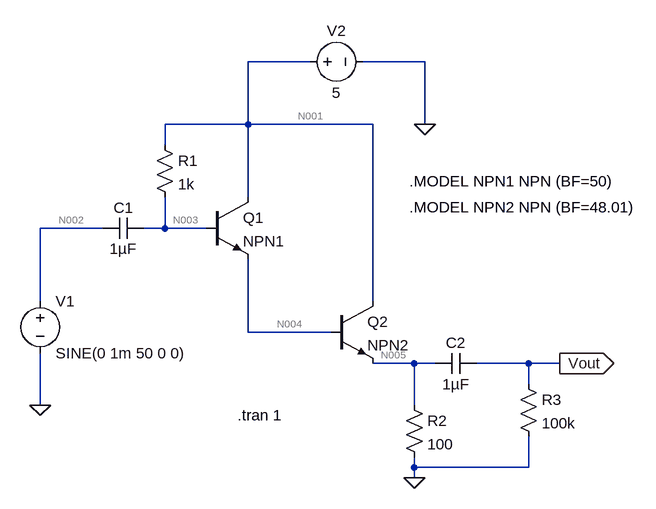
[diagram p0: schematic Q3.asc]
Q3.asc, the LTspice schematic file:
Version 4
SHEET 1 880 680
WIRE 352 -128 256 -128
WIRE 528 -128 432 -128
WIRE 256 -32 256 -128
WIRE 256 -32 128 -32
WIRE 448 -32 256 -32
WIRE 528 -32 528 -128
WIRE 128 0 128 -32
WIRE 256 80 256 -32
WIRE 32 128 -64 128
WIRE 128 128 128 80
WIRE 128 128 96 128
WIRE 192 128 128 128
WIRE -64 240 -64 128
WIRE 448 240 448 -32
WIRE 256 288 256 176
WIRE 384 288 256 288
WIRE 512 336 448 336
WIRE 544 336 512 336
WIRE 688 336 608 336
WIRE 736 336 688 336
WIRE 688 368 688 336
WIRE -64 400 -64 320
WIRE 512 400 512 336
WIRE 512 496 512 480
WIRE 688 496 688 448
WIRE 688 496 512 496
WIRE 512 512 512 496
FLAG 528 -32 0
FLAG 512 512 0
FLAG -64 400 0
FLAG 736 336 Vout
IOPIN 736 336 Out
SYMBOL res 496 384 R0
SYMATTR InstName R2
SYMATTR Value 100
SYMBOL res 112 -16 R0
SYMATTR InstName R1
SYMATTR Value 1k
SYMBOL cap 96 112 R90
WINDOW 0 0 32 VBottom 2
WINDOW 3 32 32 VTop 2
SYMATTR InstName C1
SYMATTR Value 1µF
SYMBOL voltage -64 224 R0
WINDOW 123 0 0 Left 0
WINDOW 39 0 0 Left 0
SYMATTR InstName V1
SYMATTR Value SINE(0 1m 50 0 0)
SYMBOL voltage 336 -128 R270
WINDOW 0 32 56 VTop 2
WINDOW 3 -32 56 VBottom 2
WINDOW 123 0 0 Left 0
WINDOW 39 0 0 Left 0
SYMATTR InstName V2
SYMATTR Value 5
SYMBOL npn 192 80 R0
SYMATTR InstName Q1
SYMATTR Value NPN1
SYMBOL npn 384 240 R0
SYMATTR InstName Q2
SYMATTR Value NPN2
SYMBOL cap 608 320 R90
WINDOW 0 0 32 VBottom 2
WINDOW 3 32 32 VTop 2
SYMATTR InstName C2
SYMATTR Value 1µF
SYMBOL res 672 352 R0
SYMATTR InstName R3
SYMATTR Value 100k
TEXT 504 56 Left 2 !.MODEL NPN1 NPN (BF=50)
TEXT 504 96 Left 2 !.MODEL NPN2 NPN (BF=48.01)
TEXT 240 416 Left 2 !.tran 1

The netlist it stands for:
* Q3.asc
R2 N005 0 100
R1 N001 N003 1k
C1 N003 N002 1µF
V1 N002 0 SINE(0 1m 50 0 0)
V2 N001 0 5
Q1 N001 N003 N004 0 NPN1
Q2 N001 N004 N005 0 NPN2
C2 Vout N005 1µF
R3 Vout 0 100k
.model NPN NPN
.model PNP PNP
.lib standard.bjt
.MODEL NPN1 NPN (BF=50)
.MODEL NPN2 NPN (BF=48.01)
.tran 1
.backanno
.end

* Results of the author's LTspice run, read from the files saved beside the schematic
* Operating Point, zero values left out:
*   V(n005) = 3.358 V
*   V(n001) = 5 V
*   V(n003) = 4.987 V
*   V(n004) = 4.223 V
*   Ic(Q2) = 32.9 mA
*   Ib(Q2) = 685.2 µA
*   Ie(Q2) = -33.58 mA
*   Ic(Q1) = 671.7 µA
*   Ib(Q1) = 13.43 µA
*   Ie(Q1) = -685.2 µA
*   I(R1) = 13.43 µA
*   I(R2) = 33.58 mA
*   I(V2) = -33.58 mA
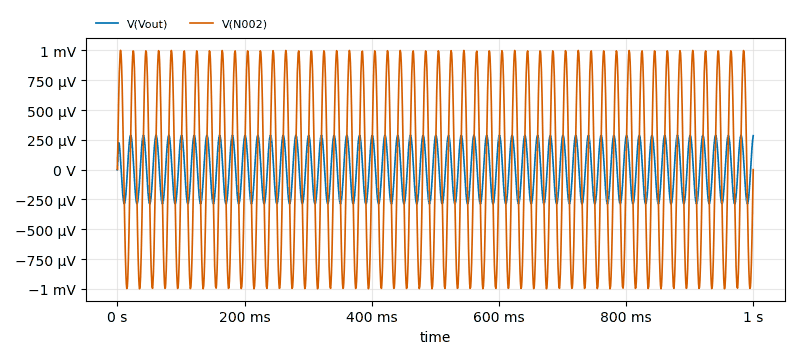
[diagram p1: Transient Analysis of Q3.asc, plotted from the saved traces]
* Transient Analysis, 1 run:
*   V(Vout): min -288.9 µV, max 289 µV, average -267.8 nV, rms 204.2 µV, last 284.9 µV
*   V(N002): min -999 µV, max 1 mV, average 5.992 nV, rms 708.3 µV, last 0 V